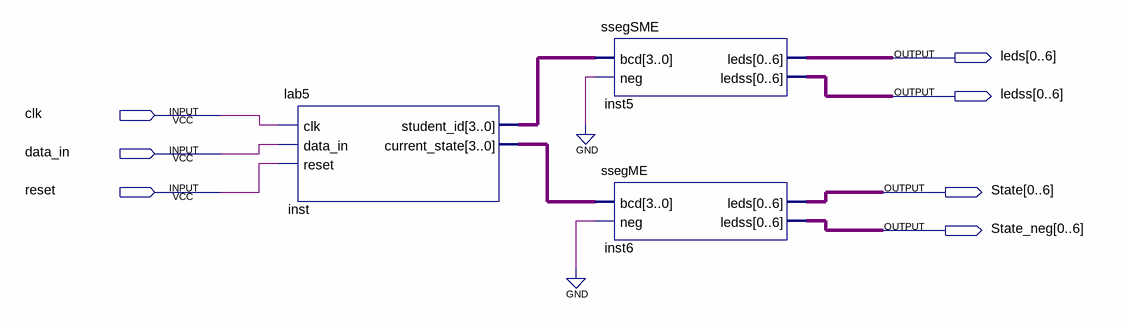
[diagram p0: schematic sheet]
// Quartus schematic Mealy.bdf as structural Verilog: 3 symbols, 7 pins
module Mealy (
  input  clk,
  input  data_in,
  input  reset,
  output [0:6] leds,
  output [0:6] ledss,
  output [0:6] State,
  output [0:6] State_neg
);

  wire [3:0] inst_current_state, inst_student_id;

  lab5 inst (
    .clk(clk), .data_in(data_in), .reset(reset), .student_id(inst_student_id),
    .current_state(inst_current_state));
  ssegSME inst5 (.bcd(inst_student_id), .neg(1'b0), .leds(leds), .ledss(ledss));
  ssegME inst6 (.bcd(inst_current_state), .neg(1'b0), .leds(State), .ledss(State_neg));
endmodule
